# Altium schematic sheet ESP-OLED.SchDoc
size A
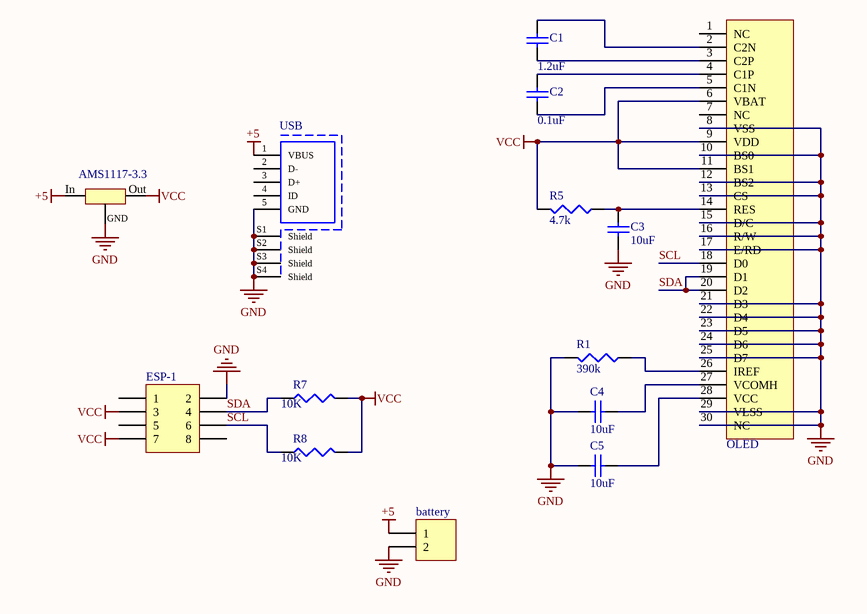
[diagram p0: ESP-OLED.SchDoc]

## Parts
battery  Header 2  [HDR1X2]  (value not drawn)
C1  value 1.2uF  [1608[0603]]  (hidden comment: Cap Semi)
C2  value 0.1uF  [1608[0603]]  (hidden comment: Cap Semi)
C3  value 10uF  [1608[0603]]  (hidden comment: Cap Semi)
C4  value 10uF  [1608[0603]]  (hidden comment: Cap Semi)
C5  value 10uF  [1608[0603]]  (hidden comment: Cap Semi)
ESP-1  Header 4X2  [ESP-01]  (value not drawn)
OLED  OLED  [oled0.96_no3d]  (value not drawn)
R1  value 390k  [J1-0603]  (hidden comment: Res3)
R5  value 4.7k  [J1-0603]  (hidden comment: Res3)
R7  value 10K  [J1-0603]  (hidden comment: Res3)
R8  value 10K  [J1-0603]  (hidden comment: Res3)
reg  AMS1117-3.3  [SOT223]
USB  Micro USB 2.0 Type B Receptacle  [629105150521]  (value not drawn)

## Nets
+5: battery.1 reg.3 USB.1(VBUS)
GND: battery.2 C3.1 C4.2 C5.2 ESP-1.2 OLED.8(VSS) OLED.10(BS0) OLED.12(BS2) OLED.13(CS) OLED.15(D/C) OLED.16(R/W) OLED.17(E/RD) OLED.21(D3) OLED.22(D4) OLED.23(D5) OLED.24(D6) OLED.25(D7) OLED.29(VLSS) OLED.30(NC) R1.2 reg.1 USB.5(GND) USB.S1(Shield) USB.S2(Shield) USB.S3(Shield) USB.S4(Shield)
VCC: ESP-1.3 ESP-1.7 OLED.6(VBAT) OLED.9(VDD) OLED.11(BS1) R5.2 R7.2 R8.2 reg.2
SCL: ESP-1.6 OLED.18(D0) R8.1
SDA: ESP-1.4 OLED.19(D1) OLED.20(D2) R7.1
NetC1_1: C1.1 OLED.3(C2P)
NetC1_2: C1.2 OLED.2(C2N)
NetC2_1: C2.1 OLED.5(C1N)
NetC2_2: C2.2 OLED.4(C1P)
NetC3_2: C3.2 OLED.14(RES) R5.1
NetC4_1: C4.1 OLED.27(VCOMH)
NetC5_1: C5.1 OLED.28(VCC)
NetOLED_26: OLED.26(IREF) R1.1

Not connected (* = marked no-connect by the designer): ESP-1 1 5 8; OLED 1(NC) 7(NC); USB 2(D-) 3(D+) 4(ID)

## Notes on the sheet
- (in symbol AMS1117-3.3) In; Out; GND

## Library data of the parts
battery = Header 2: Header, 2-Pin; LatestRevisionDate: 17-Jul-2002; LatestRevisionNote: Re-released for DXP Platform.; Publisher: Altium Limited
C1-C5 = Cap Semi: Capacitor (Semiconductor SIM Model); Published: 8-Jun-2000; LatestRevisionDate: 29-May-2009; LatestRevisionNote: IPC-7351 Footprint Added.; PackageReference: C1206; Publisher: Altium Limited; PackageDescription: Chip Capacitor
ESP-1 = Header 4X2: Header, 4-Pin, Dual row; LatestRevisionDate: 17-Jul-2002; LatestRevisionNote: Re-released for DXP Platform.; Publisher: Altium Limited
OLED = OLED0.96
R1 R5 R7 R8 = Res3: Resistor; Published: 8-Jun-2000; LatestRevisionDate: 29-May-2009; LatestRevisionNote: IPC-7351 Footprint Added.; PackageReference: J1-0603; Publisher: Altium Limited; PackageDescription: Chip Resistor
USB = 629105150521: Micro USB 2.0 Type B, Receptacle, Horizontal, SMT, with Pegs; Rated Current: 3A; Pin Number: 5; Interface Type: Type B; Working Voltage: 30VAC; ComponentLink1Description: Manufacturer; ComponentLink1URL: http://www.we-online.de; ComponentLink2Description: Datasheet; ComponentLink2URL: https://katalog.we-online.com/em/datasheet/629105150521.pdf; Published Date: September 2019; Publisher: Wurth Elektronik; Part Number: 629105150521; Gender: Receptacle; Type: Horizontal; Packaging: Tape and Reel; Operating Temperature: -40 to +85degC; Mounting Technology: SMT; Application: Micro USB 2.0